# Altium schematic sheet Sheet1.SchDoc: ESP8266 Wireless Terminal
size A4; Date: Feb 2017; Author: Ondřej Hruška; CompanyName: FEL ČVUT; Revision: v1
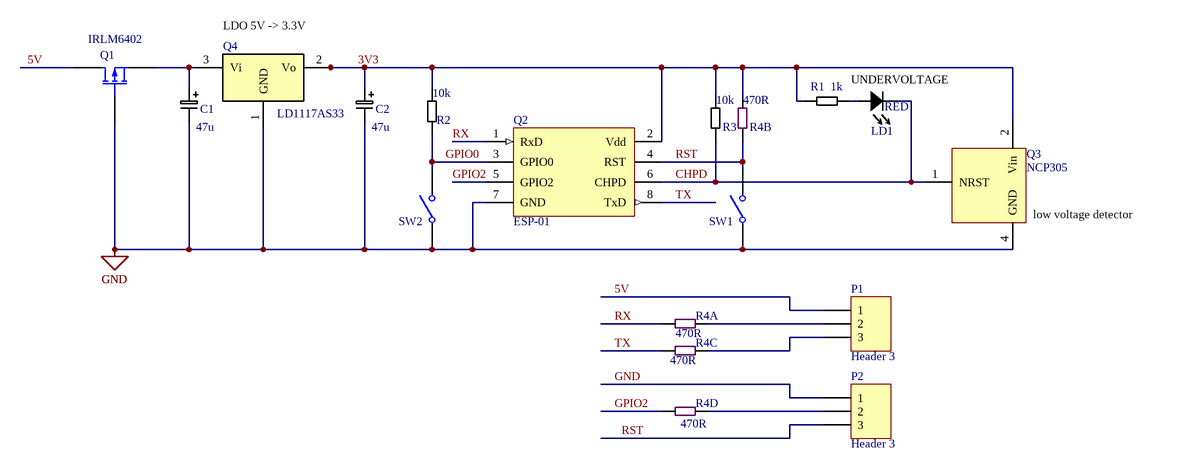
[diagram p0: Sheet1.SchDoc]

## Parts
C1  47u  [CPol_B]
C2  47u  [CPol_B]
LD1  RED  [LED_SMD]
P1  Header 3  [PIN_1x3_SPARSE]
P2  Header 3  [PIN_1x3_SPARSE]
Q1  IRLM6402  [SOT23]
Q2  ESP-01  [ESP_01]
Q3  NCP305  [SC-82]
Q4  value LD1117AS33  [SOT-223/DSO-G3/D6.7]  (hidden comment: LD1117A)
R1  1k  [R0805]
R2  10k  [R0805]
R3  10k  [R0805]
R4  470R  [R1206_Array_longpad]  (parts A,B,C,D of 4)
SW1  SW  [TURTLE_BTN]  (value not drawn)
SW2  SW  [TURTLE_BTN]  (value not drawn)

## Nets
GND: C1.2 C2.2 P2.1 Q1.1(G) Q2.7(GND) Q3.4(GND) Q4.1(GND) SW1.1(COMMON) SW2.1(COMMON)
3V3: C2.1 Q2.2(Vdd) Q3.2(Vin) Q4.2(Vo) Q4.4(Vo) R1.2 R2.1 R3.1 R4.4
5V: P1.1 Q1.3(D)
CHPD: LD1.C Q2.6(CHPD) Q3.1(NRST) R3.2
GPIO0: Q2.3(GPIO0) R2.2 SW2.2(NO)
GPIO2: Q2.5(GPIO2) R4.7
RST: P2.3 Q2.4(RST) R4.3 SW1.2(NO)
RX: Q2.1(RxD) R4.1
TX: Q2.8(TxD) R4.5
NetC1_1: C1.1 Q1.2(S) Q4.3(Vi)
NetLD1_A: LD1.A R1.1
NetP1_2: P1.2 R4.2
NetP1_3: P1.3 R4.6
NetP2_2: P2.2 R4.8

Not connected (* = marked no-connect by the designer): Q3 3(NC)

## Notes on the sheet
- (near Q4) LDO 5V -> 3.3V
- UNDERVOLTAGE
- (near Q3) low voltage detector
- Title
- Size:
- Date:
- A4
- Number:
- Time:
- Revision:
- Sheet
- of
- File:

## Library data of the parts
C1 C2 = C_EL: Supplier Part Number 1: Capacitor electrolytic, 50V, 5x11mm; Supplier 1: Farnell; Value: 47u
LD1 = LED: Value: TBD
P1 P2 = Header 3: Header, 3-Pin; LatestRevisionDate: 17-Jul-2002; LatestRevisionNote: Re-released for DXP Platform.; Publisher: Altium Limited
Q1 = BSS84: P-Channel Enhancement Mode Vertical DMOS FET; Value: BSS84; Supplier 1: Farnell; Supplier Part Number 1: 1094997; Supplier 2: GME; Supplier Part Number 2: 912-041; HelpURL: http://www.farnell.com/datasheets/1718091.pdf; Model: BSS84; Package: SOT23
Q2 = ESP_01: ESP-01 in socket
Q3 = NCP305: Voltage Watchdog
Q4 = LD1117A: Low drop fixed and adjustable positive voltage regulators; HelpURL: http://www2.st.com/content/ccc/resource/technical/document/datasheet/a5/c3/3f/c9/2b/15/40/49/CD00002116.pdf/files/CD00002116.pdf/jcr:content/translations/en.CD00002116.pdf; Supplier 3: ST Internal; Supplier Part Number 3: LD1117ASxxTR where xx = 12, 18, 33 or blank
R1-R3 = R: Supplier Part Number 1: any R0805 1%; Supplier 1: Farnell
  R1: Value: 1k
  R2 R3: Value: 10k
R4 = R_ARRAY: Value: 470R
SW1 SW2 = SW_SPST_4PAD